# Altium project PCB_Project.PrjPcb
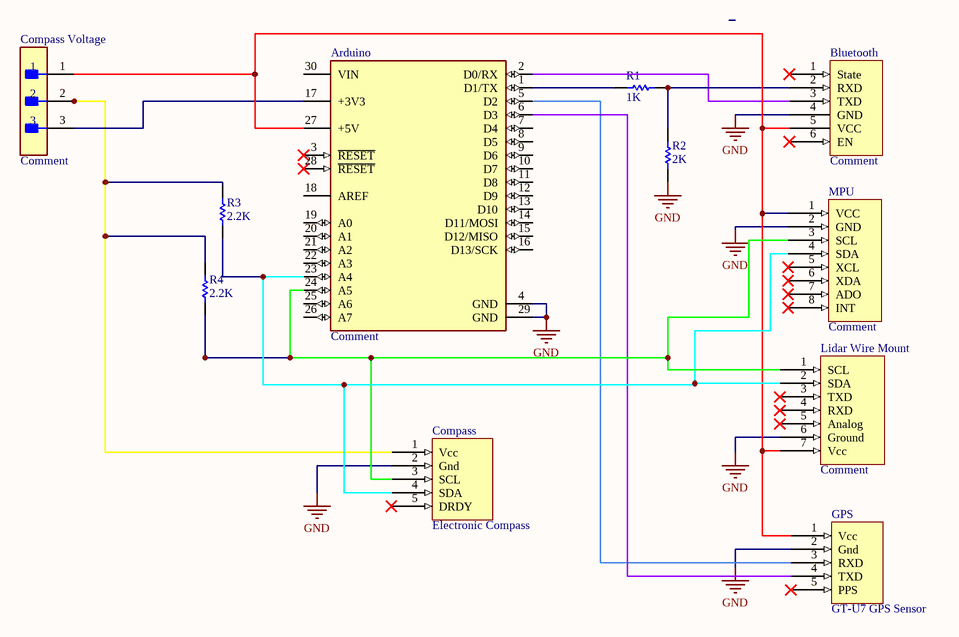
[diagram p0: ar_pcb_connection.SchDoc]
1 sheet, 11 parts. Net scope: global (net labels, ports and power ports of the same name join across sheets).
Board file: ar_pcb.PcbDoc

## Sheet ar_pcb_connection.SchDoc
size A4; SheetNumber: 1; SheetTotal: 1

### Parts
Arduino  Comment  [FP-A000005-MFG]
Bluetooth  Comment  [hm10-Footprint-1]
Compass  Electronic Compass  [Electronic Compass-Footprint-1]
Compass_Voltage  Comment  [FP-M22-2010305-MFG]
GPS  GT-U7 GPS Sensor  [GT-U7 GPS Sensor-Footprint-1]
Lidar_Wire_Mount  Comment  [SF11_C lidar module-Footprint-1]
MPU  Comment  [mpu6050-Footprint-1]
R1  value 1K  (hidden comment: Resistor)
R2  R1: 2K  (hidden comment: Resistor)
R3  R1: 2.2K  (hidden comment: Resistor)
R4  R4: 2.2K  (hidden comment: Resistor)

### Nets
GND: Arduino.4(GND) Arduino.29(GND) Bluetooth.4(GND) Compass.2(Gnd) GPS.2(Gnd) Lidar_Wire_Mount.6(Ground) MPU.2(GND) R2.2
NetArduino_1: Arduino.1(D1/TX) R1.2
NetArduino_2: Arduino.2(D0/RX) Bluetooth.3(TXD)
NetArduino_5: Arduino.5(D2) GPS.3(RXD)
NetArduino_6: Arduino.6(D3) GPS.4(TXD)
NetArduino_17: Arduino.17(+3V3) Compass_Voltage.3
NetArduino_23: Arduino.23(A4) Compass.4(SDA) Lidar_Wire_Mount.2(SDA) MPU.4(SDA) R3.1
NetArduino_24: Arduino.24(A5) Compass.3(SCL) Lidar_Wire_Mount.1(SCL) MPU.3(SCL) R4.1
NetArduino_27: Arduino.27(+5V) Bluetooth.5(VCC) Compass_Voltage.1 GPS.1(Vcc) Lidar_Wire_Mount.7(Vcc) MPU.1(VCC)
NetBluetooth_2: Bluetooth.2(RXD) R1.1 R2.1
NetCompass_1: Compass.1(Vcc) Compass_Voltage.2 R3.2 R4.2

Not connected (* = marked no-connect by the designer): Arduino 3(~{RESET})* 7(D4) 8(D5) 9(D6) 10(D7) 11(D8) 12(D9) 13(D10) 14(D11/MOSI) 15(D12/MISO) 16(D13/SCK) 18(AREF) 19(A0) 20(A1) 21(A2) 22(A3) 25(A6) 26(A7) 28(~{RESET})* 30(VIN); Bluetooth 1(State)* 6(EN)*; Compass 5(DRDY)*; GPS 5(PPS)*; Lidar_Wire_Mount 3(TXD)* 4(RXD)* 5(Analog)*; MPU 5(XCL)* 6(XDA)* 7(ADO)* 8(INT)*

### Library data of the parts
Arduino = CMP-189986-000002-1: ARDUINO NANO ATMEGA328 EVAL BRD; Number of Bits: 8; Evaluation Kit: Yes; Operating Supply Voltage: 12V; Interface: I2C; Data Bus Width: 8b; Core Architecture: AVR; Packaging: Bulk; Length: 7inch; Package Quantity: 50; Width: 5inch; REACH SVHC: No SVHC; Weight: 0.358383oz; Series: AVR® ATmega; Height: 0.25inch
Bluetooth = HM10-BLE-module-2: HM10-BLE module
Compass = CMP-00030-00001-4: Electronic Compass GY271 HMC5883L
Compass_Voltage = CMP-15831-000100-1: CONN HEADER VERT 3POS 2MM; Voltage Rating (AC): 250V; Current Rating: 1A; Contact Resistance: 20mR; Number of Positions: 3; Mated Stacking Heights: 8.6mm; Voltage Rating: 650V; Insulation Resistance: 10GR; Connector Type: Male Pin; Contact Shape: Square; Min Operating Temperature: -55°C; Lead Pitch: 2mm; Contact Plating: Gold; Pitch: 2mm; Max Operating Temperature: 105°C; Color: Black; Series: M22; Orientation: Straight; Number of Contacts: 3; Max Current Rating: 1A; Contact Material: Bronze; Packaging: Bulk; Housing Color: Black; Housing Material: Nylon; Mount: Through Hole; Case/Package: SIL; Working Voltage: 250V; Reach SVHC Compliant: Yes; Number of Rows: 1; Package Quantity: 1000; Insulation Material: Nylon; Length: 6mm; Contact Finish - Mating: GOLD; Depth: 2mm; Contact Type: Male Pin; Insulation Color: Black; Termination: Solder; RoHS Compliant: Yes; Radiation Hardening: No; Flammability Rating: UL94 V-0; Contact Mating Length: 0.138inch; Fastening Type: Pull
GPS = CMP-00030-00005-5: GPS sensor
Lidar_Wire_Mount = SF11/C-3: SF11/C lidar module
MPU = MPU6050-throughhole-4: MPU-6050 through hole
R1-R4 = Resistor: TC1: 0; SimulationGenericComponent: True; TC2: 0